# EAGLE design Stefan2 (EAGLE 9.6.2)
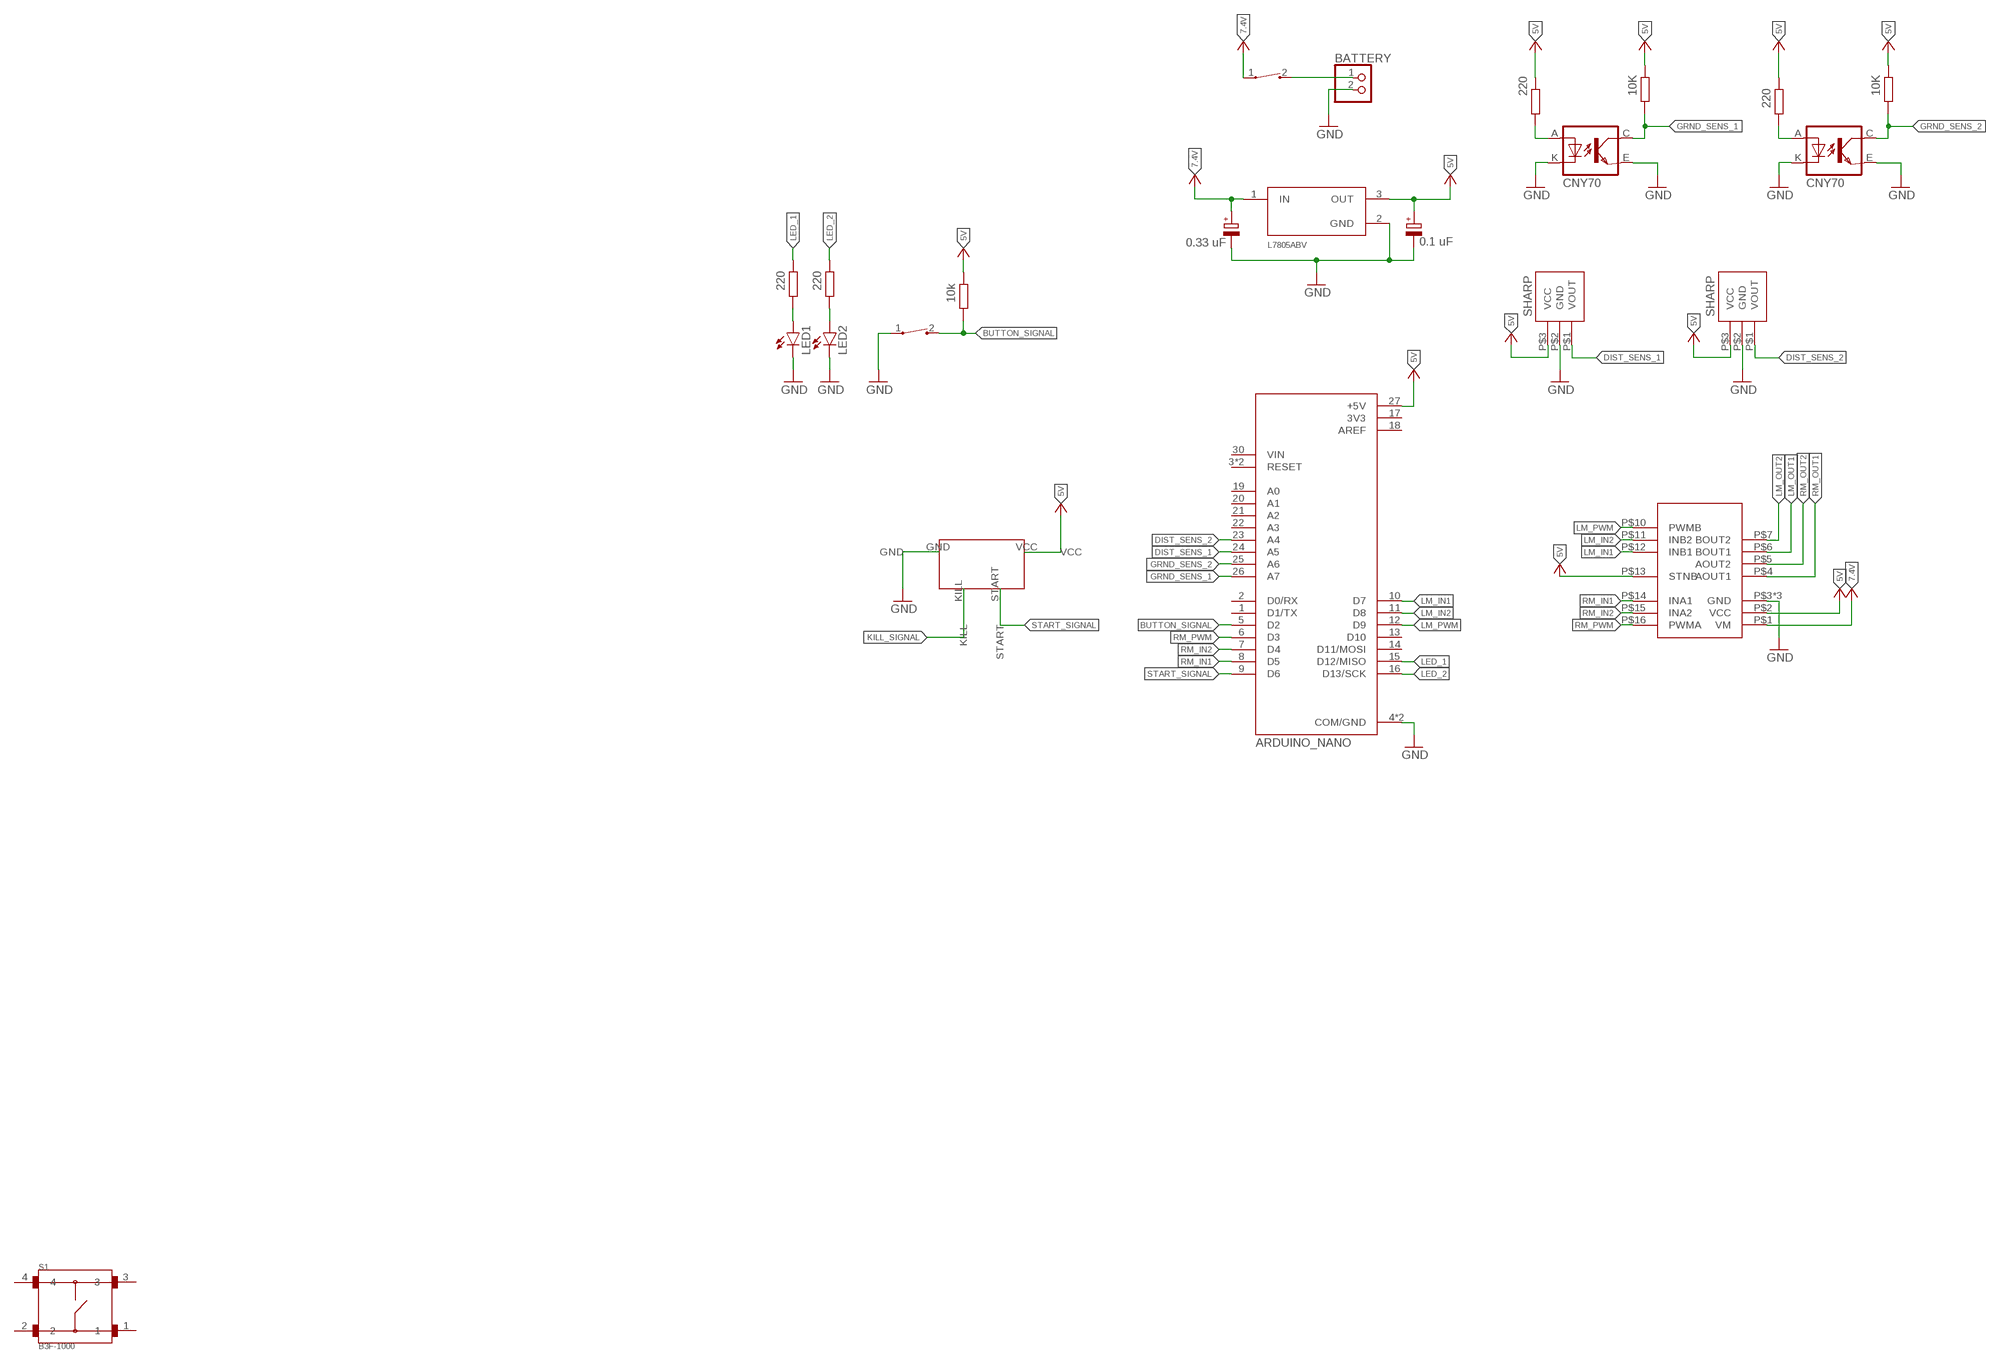
[diagram p0: schematic, sheet 1]

## Parts
BATTERY  PINHD-1X2  [1X02]
C1  0.33 uF  CPOL-EUSANYO_A  [SANYO-OSCON_A]
C2  0.1 uF  CPOL-EUSANYO_A  [SANYO-OSCON_A]
LED1  LED5MM  [LED5MM]
LED2  LED5MM  [LED5MM]
R1  220  R-EU_0207/10  [0207/10]
R3  10K  R-EU_0207/10  [0207/10]
R4  220  R-EU_0207/10  [0207/10]
R5  10k  R-EU_0207/10  [0207/10]
R6  220  R-EU_0207/10  [0207/10]
R7  220  R-EU_0207/10  [0207/10]
R8  10K  R-EU_0207/10  [0207/10]
S1  B3F-1000  [SW_B3F-1000]
SUMO_START_MODULE  SUMO_START_MODULE  [SUMO_START_MODULE]
SW1  147873-1  [SW_147873-1]
SW2  147873-1  [SW_147873-1]
TB1  ARDUINO_NANO  [SHIELD_ARDUINO_NANO]
TB6612  TB6612MODULE  [TB6612MODULE]
U1  SHARP  GP2D120  [GP2DXX]
U2  L7805ABV  [TO254P460X1020X1945-3P]
U3  SHARP  GP2D120  [GP2DXX]
U$1  CNY70  [4]
U$3  CNY70  [4]

## Nets
5V: C2.+ R1.2 R3.2 R5.2 R7.2 R8.2 SUMO_START_MODULE.VCC TB1.27(+5V) TB6612.P$2(VCC) TB6612.P$13(STNB) U1.P$3(VCC) U2.3(OUT) U3.P$3(VCC) ; supply symbol labelled VCC
7.4V: C1.+ SW2.1 TB6612.P$1(VM) U2.1(IN) ; supply symbol labelled VCC
BUTTON_SIGNAL: R5.1 SW1.2 TB1.5(D2)
DIST_SENS_1: TB1.24(A5) U1.P$1(VOUT)
DIST_SENS_2: TB1.23(A4) U3.P$1(VOUT)
GND: BATTERY.2 C1.- C2.- LED1.K(C) LED2.K(C) SUMO_START_MODULE.GND SW1.1 TB1.4(COM/GND) TB1.29(COM/GND) TB6612.P$3(GND) TB6612.P$8(GND) TB6612.P$9(GND) U2.2(GND) U$1.E(EMI) U$1.K(C) U$3.E(EMI) U$3.K(C)
GRND_SENS_1: R3.1 TB1.26(A7) U$3.C(COL)
GRND_SENS_2: R8.1 TB1.25(A6) U$1.C(COL)
KILL_SIGNAL: SUMO_START_MODULE.KILL
LED_1: R4.2 TB1.15(D12/MISO)
LED_2: R6.2 TB1.16(D13/SCK)
LM_IN1: TB1.10(D7) TB6612.P$12(INB1)
LM_IN2: TB1.11(D8) TB6612.P$11(INB2)
LM_OUT1: TB6612.P$6(BOUT1)
LM_OUT2: TB6612.P$7(BOUT2)
LM_PWM: TB1.12(D9) TB6612.P$10(PWMB)
N$1: LED1.A R4.1
N$2: LED2.A R6.1
N$3: R1.1 U$3.A
N$4: R7.1 U$1.A
N$5: BATTERY.1 SW2.2
N$6: U1.P$2(GND) U3.P$2(GND) ; supply symbol labelled GND
RM_IN1: TB1.8(D5) TB6612.P$14(INA1)
RM_IN2: TB1.7(D4) TB6612.P$15(INA2)
RM_OUT1: TB6612.P$4(AOUT1)
RM_OUT2: TB6612.P$5(AOUT2)
RM_PWM: TB1.6(D3) TB6612.P$16(PWMA)
START_SIGNAL: SUMO_START_MODULE.START TB1.9(D6)
Unconnected: S1.1 S1.2 S1.3 S1.4 TB1.1(D1/TX) TB1.2(D0/RX) TB1.3(RESET) TB1.13(D10) TB1.14(D11/MOSI) TB1.19(A0) TB1.20(A1) TB1.21(A2) TB1.22(A3) TB1.28(RESET) TB1.30(VIN)

## Power pins joined to a net without a drawn wire
3V3: TB1.17(3V3)
AREF: TB1.18(AREF)

## Library data of the parts
BATTERY = pinhead:PINHD-1X2: PIN HEADER
C1 C2 = rcl:CPOL-EU: POLARIZED CAPACITOR, European symbol; SPICEPREFIX: C
LED1 LED2 = led:LED: LED OSRAM: - CHIPLED LG R971, LG N971, LY N971, LG Q971, LY Q971, LO R971, LY R971 LH N974, LH R974 LS Q976, LO Q976, LY Q976 LO Q996 - Hyper CHIPLED LW Q18S LB Q993, LB Q99A, LB R99A - SideLED LS A670, LO A670, LY A670, LG A670, LP A670 LB A673, LV A673, LT A673, LW A673 LH A674 LY A675 LS A676, LA A676, LO A676, LY A676, LW A676 LS A679, LY A679, LG A679 - Hyper Micro SIDELED® LS Y876, LA Y876, LO Y876, LY Y876 LT Y87S - SmartLED LW L88C, LW L88S LB L89C, LB L89S, LG L890 LS L89K, LO L89K, LY L89K LS L896, LA L896, LO L896, LY L896 - TOPLED LS T670, LO T670, LY T670, LG T670, LP T670 LSG T670, LSP T670, LSY T670, LOP T670, LYG T670 LG T671, LOG T671, LSG T671 LB T673, LV T673, LT T673, LW T673 LH T674 LS T676, LA T676, LO T676, LY T676, LB T676, LH T676, LSB T676, LW T676 LB T67C, LV T67C, LT T67C, LS T67K, LO T67K, LY T67K, LW E67C LS E67B, LA E67B, LO E67B, LY E67B, LB E67C, LV E67C, LT E67C LW T67C LS T679, LY T679, LG T679 LS T770, LO T770, LY T770, LG T770, LP T770 LB T773, LV T773, LT T773, LW T773 LH T774 LS E675, LA E675, LY E675, LS T675 LS T776, LA T776, LO T776, LY T776, LB T776 LHGB T686 LT T68C, LB T68C - Hyper Mini TOPLED® LB M676 - Mini TOPLED Santana® LG M470 LS M47K, LO M47K, LY M47K Source: http://www.osram.convergy.de LUXEON: - LUMILED® LXK2-PW12-R00, LXK2-PW12-S00, LXK2-PW14-U00, LXK2-PW14-V00 LXK2-PM12-R00, LXK2-PM12-S00, LXK2-PM14-U00 LXK2-PE12-Q00, LXK2-PE12-R00, LXK2-PE12-S00, LXK2-PE14-T00, LXK2-PE14-U00 LXK2-PB12-K00, LXK2-PB12-L00, LXK2-PB12-M00, LXK2-PB14-N00, LXK2-PB14-P00, LXK2-PB14-Q00 LXK2-PR12-L00, LXK2-PR12-M00, LXK2-PR14-Q00, LXK2-PR14-R00 LXK2-PD12-Q00, LXK2-PD12-R00, LXK2-PD12-S00 LXK2-PH12-R00, LXK2-PH12-S00 LXK2-PL12-P00, LXK2-PL12-Q00, LXK2-PL12-R00 Source: www.luxeon.com KINGBRIGHT: KA-3528ASYC Source: www.kingbright.com
R1 R3-R8 = rcl:R-EU_: RESISTOR, European symbol; SPICEPREFIX: R
S1 = B3F-1000:B3F-1000: Switch, FLUX TIGHT MECHANICAL KEYSwitch, , 50MA@24VDC, NO GROUND TERM., FLAT PLUNG Check availability <https://pricing.snapeda.com/parts/B3F-1000/Omron/view-part?ref=eda>; AVAILABILITY: In Stock; DESCRIPTION: Tactile Switch SPST-NO Top Actuated Through Hole; MF: Omron; MP: B3F-1000; PACKAGE: None; PRICE: None; PURCHASE-URL: https://pricing.snapeda.com/search/part/B3F-1000/?ref=eda
SUMO_START_MODULE = SUMO_START_MODULE:SUMO_START_MODULE
SW1 SW2 = 147873-1:147873-1: Switch Tactile OFF (ON) SPST Rectangular Button J-Bend 0.05A 24VDC 1.77N SMD T/R Check availability <https://pricing.snapeda.com/parts/147873-1/TE%20Connectivity/view-part?ref=eda>; AVAILABILITY: In Stock; COMMENT: 147873-1; DESCRIPTION: Switch Tactile OFF (ON) SPST Rectangular Button J-Bend 0.05A 24VDC 1.77N SMD T/R; MF: TE Connectivity; MP: 147873-1; PACKAGE: None; PRICE: None; PURCHASE-URL: https://pricing.snapeda.com/search/part/147873-1/?ref=eda
TB1 = ARDUINO_NANO:ARDUINO_NANO: Arduino Nano, Through Hole Check availability <https://pricing.snapeda.com/parts/Arduino%20Nano/Arduino/view-part?ref=eda>; AVAILABILITY: Not in stock; DESCRIPTION: Small, complete, and breadboard-friendly board based on the ATmega328 (Arduino Nano 3.x); MF: Arduino; MP: Arduino Nano; PACKAGE: Non-Standard Arduino; PRICE: None
TB6612 = TB6612MODULE:TB6612MODULE
U1 U3 = GP2D120:GP2D120: Check availability <https://pricing.snapeda.com/parts/GP2D120/Sharp/view-part?ref=eda>; AVAILABILITY: In Stock; DESCRIPTION: Optical Sensor 1.57 ~ 11.81 (4 ~ 30cm) Analog Output; MF: Sharp; MP: GP2D120; PACKAGE: None; PRICE: None; PURCHASE-URL: https://pricing.snapeda.com/search/part/GP2D120/?ref=eda
U2 = L7805ABV:L7805ABV: L7805 Series 1.5 A 5 V Three Terminal Voltage Regulator - TO-220 Check availability <https://pricing.snapeda.com/parts/L7805ABV/STMicroelectronics/view-part?ref=eda>; AVAILABILITY: In Stock; DESCRIPTION: Linear Voltage Regulator IC Positive Fixed 1 Output 1.5A TO-220; MF: STMicroelectronics; MP: L7805ABV; PACKAGE: TO-220-3 STMicroelectronics; PRICE: None; PURCHASE-URL: https://pricing.snapeda.com/search/part/L7805ABV/?ref=eda
U$1 U$3 = CNY70:CNY70: Check availability <https://pricing.snapeda.com/parts/CNY70/Vishay%20Semiconductors/view-part?ref=eda>; AVAILABILITY: In Stock; DESCRIPTION: Optical Switches, Reflective, Phototransistor Output Reflective Optical Sensor w/Trans Out; MF: Vishay Semiconductors; MP: CNY70; PACKAGE: None; PRICE: None; PURCHASE-URL: https://pricing.snapeda.com/search/part/CNY70/?ref=eda

## Board
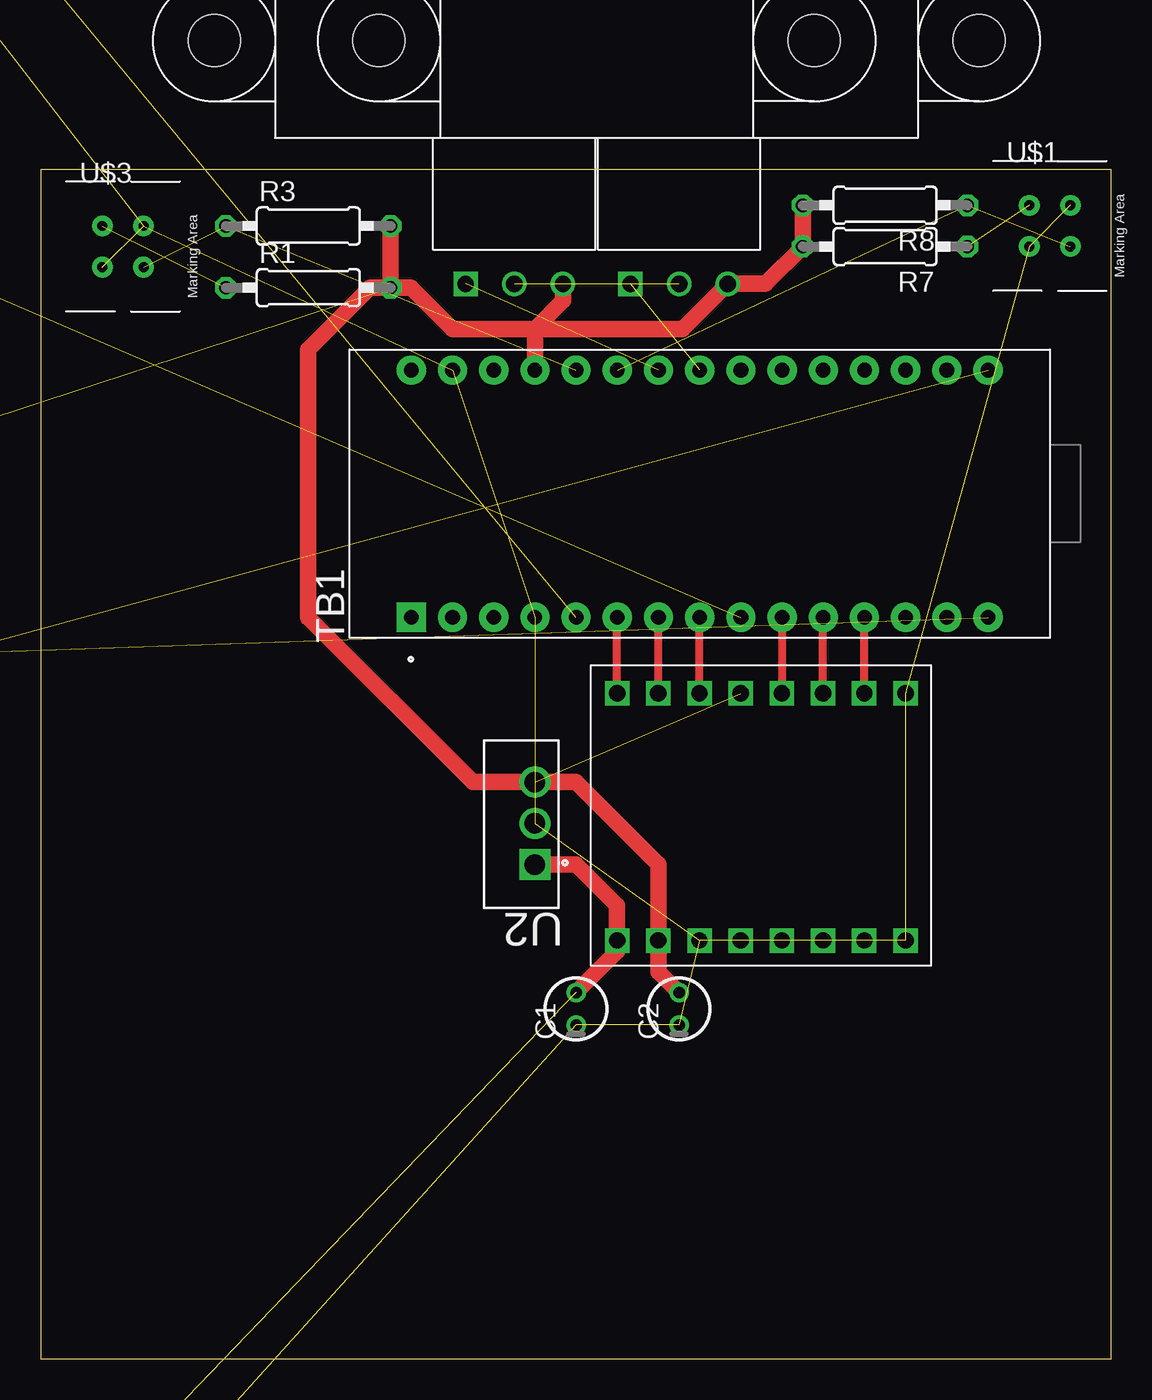
[diagram p1: board, top side]

Size 66.02 x 73.33 mm. Coordinates in mm from the lower left corner, seen from the top.
Outline: 0,0 66.02,0 66.02,73.33 0,73.33 0,0
Copper layers (1*16): Top 0.035mm / dielectric 1.5mm / Bottom 0.035mm
Design rules "default": minimum track width 6mil, minimum drill 0.35mm, track to track 6mil, track to pad 6mil, pad to pad 6mil, via to via 6mil, smd to smd 6mil, copper to edge 40mil, drill to drill 6mil, minimum pad ring 10mil, minimum via ring 8mil, stop-mask expansion 4mil, vias tented up to drill 0mil, thermal gap 10mil

### Footprints (pad centres in the part's own frame; a part is rotated, then mirrored left to right if it is on the bottom)
1X02 = drill 1.016 long: 1 -1.27,0; 2 1.27,0
SANYO-OSCON_A = drill 0.7 pad 1.1: + 1,0; - -1,0
LED5MM = drill 0.813 octagon: A -1.27,0; K 1.27,0
0207/10 = drill 0.813 octagon: 1 -5.08,0; 2 5.08,0
SW_B3F-1000 = drill 1 pad 1.6: 1 -3.25,2.25; 2 3.25,2.25; 3 -3.25,-2.25; 4 3.25,-2.25
SUMO_START_MODULE = drill 1 square: GND 0,0 | drill 1: KILL 5.08,0; START 2.54,0; VCC -2.54,0
SW_147873-1 = smd 2.8 x 2.2: 1 -2.4,0; 2 2.4,0
SHIELD_ARDUINO_NANO = drill 0.9 pad 1.8 square: 1 -7.62,17.78 | drill 0.9 pad 1.8: 2 -7.62,15.24; 3 -7.62,12.7; 4 -7.62,10.16; 5 -7.62,7.62; 6 -7.62,5.08; 7 -7.62,2.54; 8 -7.62,0; 9 -7.62,-2.54; 10 -7.62,-5.08; 11 -7.62,-7.62; 12 -7.62,-10.16; 13 -7.62,-12.7; 14 -7.62,-15.24; 15 -7.62,-17.78; 16 7.62,-17.78; 17 7.62,-15.24; 18 7.62,-12.7; 19 7.62,-10.16; 20 7.62,-7.62; 21 7.62,-5.08; 22 7.62,-2.54; 23 7.62,0; 24 7.62,2.54; 25 7.62,5.08; 26 7.62,7.62; 27 7.62,10.16; 28 7.62,12.7; 29 7.62,15.24; 30 7.62,17.78
TB6612MODULE = drill 1 square: P$1 1.64,1.54; P$2 4.18,1.54; P$3 6.72,1.54; P$4 9.26,1.54; P$5 11.8,1.54; P$6 14.34,1.54; P$7 16.88,1.54; P$8 19.42,1.54; P$9 19.42,16.78; P$10 16.88,16.78; P$11 14.34,16.78; P$12 11.8,16.78; P$13 9.26,16.78; P$14 6.72,16.78; P$15 4.18,16.78; P$16 1.64,16.78
GP2DXX = drill 1 square: P$1 -3,-15 | drill 1: P$2 0,-15; P$3 3,-15 | hole 3.2: -18.5,0; 18.5,0
TO254P460X1020X1945-3P = drill 1.27 pad 1.91 square: 1 0,2.54 | drill 1.27 pad 1.91: 2 0,0; 3 0,-2.54
4 = drill 0.61 pad 1.27: A -1.27,1.27; C 1.27,-1.27; E 1.27,1.27; K -1.27,-1.27

### Placement (x,y rotation side)
BATTERY  -87.63,-111.76 0 top  (outside the outline)
C1  33.02,21.59 90 top
C2  39.37,21.59 90 top
LED1  -31.75,104.14 0 top  (outside the outline)
LED2  -44.45,104.14 0 top  (outside the outline)
R1  16.51,66.04 0 top
R3  16.51,69.85 0 top
R4  -57.15,41.91 0 top  (outside the outline)
R5  -45.72,45.72 0 top  (outside the outline)
R6  -44.45,34.29 0 top  (outside the outline)
R7  52.07,68.58 180 top
R8  52.07,71.12 180 top
S1  -86.36,-95.25 0 top  (outside the outline)
SUMO_START_MODULE  -41.91,81.28 0 top  (outside the outline)
SW1  -17.78,104.14 0 top  (outside the outline)
SW2  -86.36,-104.14 0 top  (outside the outline)
TB1  40.64,53.34 90 top
TB6612  33.91,24.26 0 top
U1  29.21,81.28 0 top
U2  30.48,33.02 180 top
U3  39.37,81.28 0 top
U$1  62.23,69.85 0 top
U$3  5.08,68.58 0 top

### Tracks (layer width: path | path; a pad name or v marks a point on that pad's centre or on a via)
5V  (3 unrouted)
  Top 0.508: 38.09,25.4 TB6612.P$2
  Top 1.016: C2.+ 38.09,23.87 38.09,25.4 38.1,25.41 38.1,30.48 33.02,35.56 U2.3 26.67,35.56 16.51,45.72 16.51,62.23 20.32,66.04 R1.2 | R1.2 R3.2 | R8.2 R7.2 44.69,66.28 U3.P$3 39.59,63.5 30.48,63.5 | TB1.27 30.48,63.5 | U1.P$3 32.21,65.23 30.48,63.5 | R1.2 22.86,66.04 25.4,63.5 30.48,63.5
7.4V  (1 unrouted)
  Top 0.508: 35.55,25.12 TB6612.P$1
  Top 1.016: C1.+ 35.55,25.12 | U2.1 33.02,30.48 35.55,27.95 TB6612.P$1
BUTTON_SIGNAL  (2 unrouted)
DIST_SENS_1  (1 unrouted)
DIST_SENS_2  (1 unrouted)
GND  (16 unrouted)
GRND_SENS_1  (2 unrouted)
GRND_SENS_2  (2 unrouted)
LED_1  (1 unrouted)
LED_2  (1 unrouted)
LM_IN1
  Top 0.508: TB1.10 TB6612.P$12
LM_IN2
  Top 0.508: TB6612.P$11 TB1.11
LM_PWM
  Top 0.508: TB6612.P$10 TB1.12
N$1  (1 unrouted)
N$2  (1 unrouted)
N$3  (1 unrouted)
N$4  (1 unrouted)
N$5  (1 unrouted)
N$6  (1 unrouted)
RM_IN1
  Top 0.508: TB6612.P$14 40.63,45.71 TB1.8
RM_IN2
  Top 0.508: TB6612.P$15 38.09,45.71 TB1.7
RM_PWM
  Top 0.508: TB6612.P$16 35.55,45.71 TB1.6
START_SIGNAL  (1 unrouted)